# EAGLE design SeCloud (EAGLE 7.2.0)
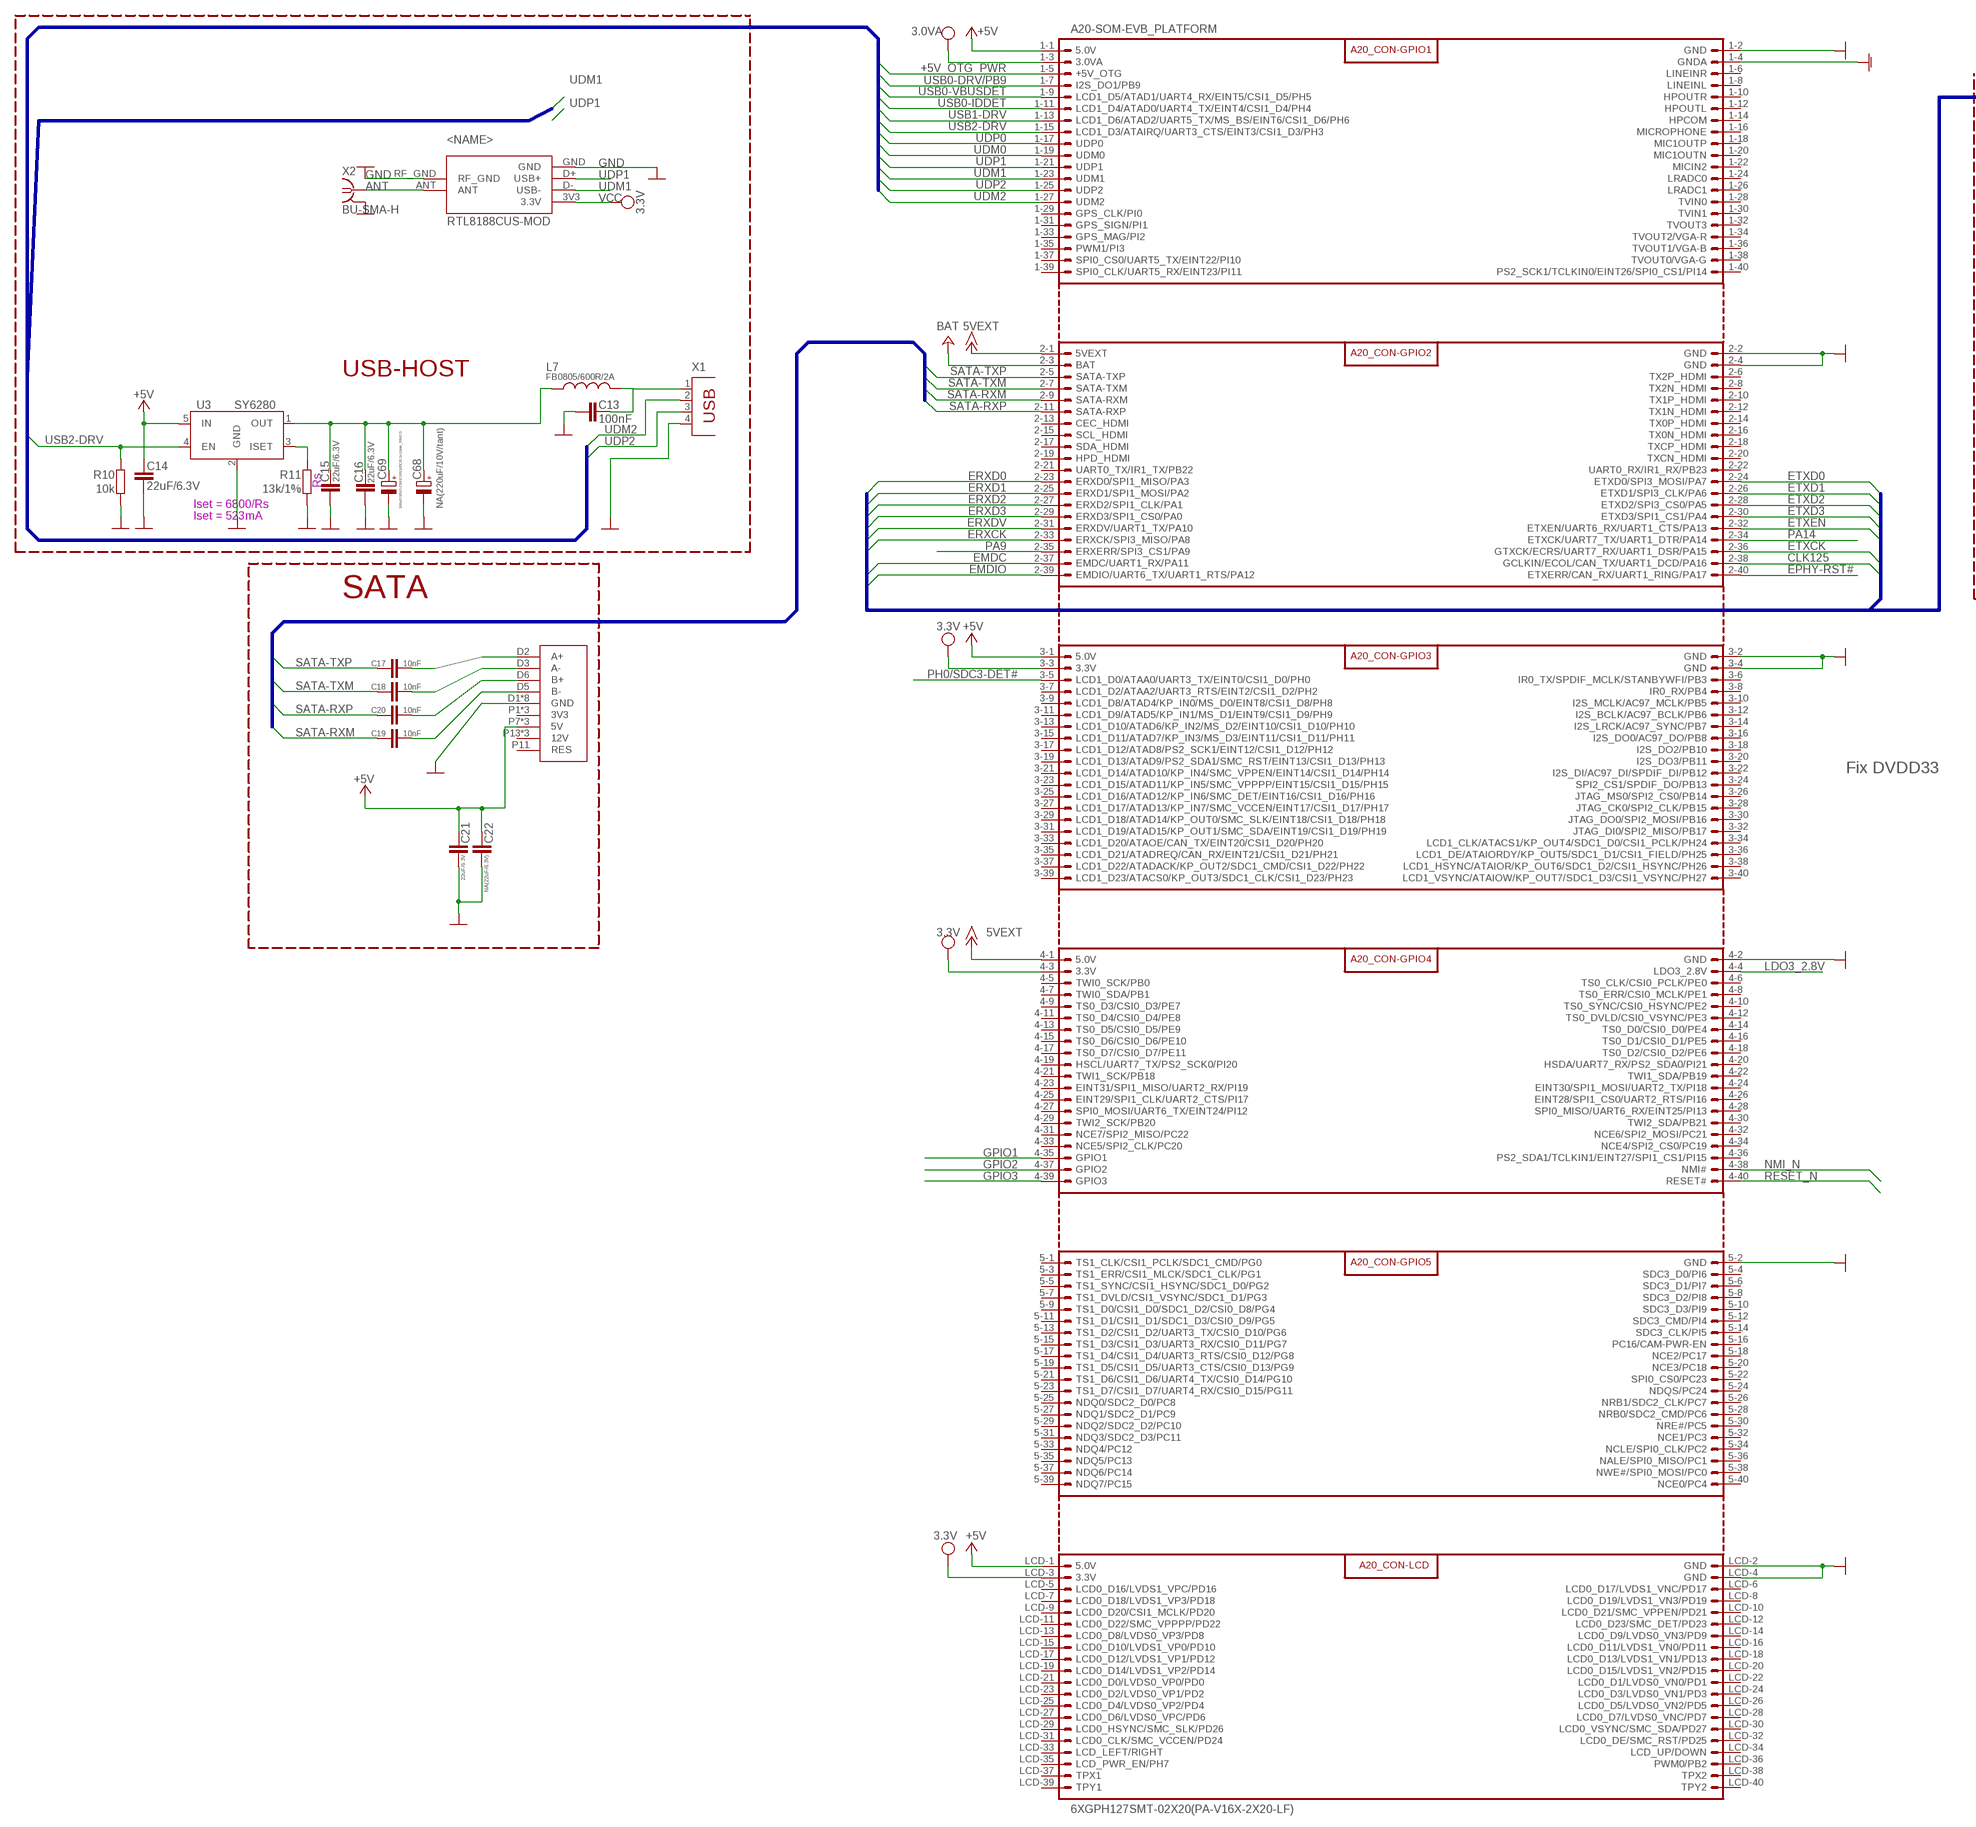
[diagram p0: schematic, sheet 1, part 1 of 2]
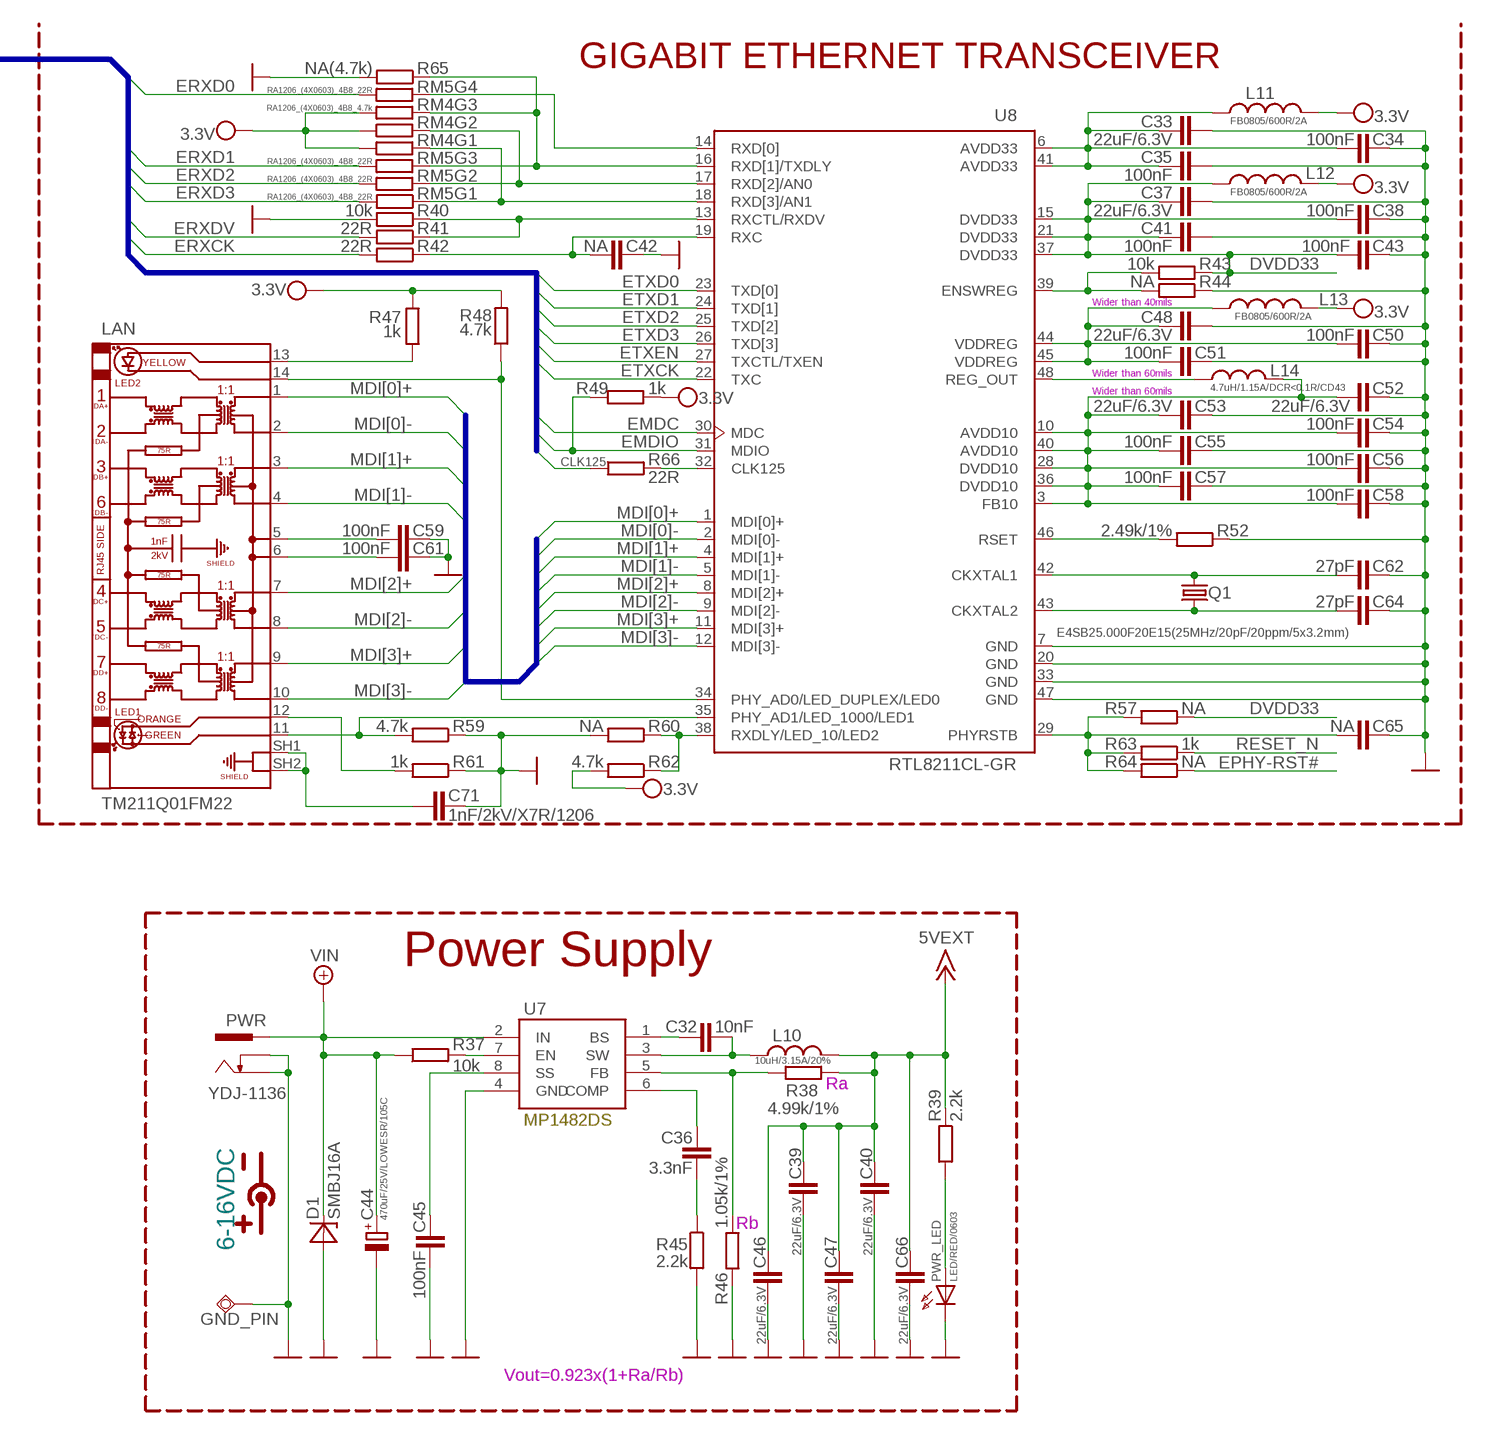
[diagram p1: schematic, sheet 1, part 2 of 2]

## Parts
A20-SOM-EVB_PLATFORM  6XGPH127SMT-02X20(PA-V16X-2X20-LF)  A20-SOM-EVB---6XGPH127SMT-02X20(PA-V16X-2X20-LF)  [A20-SOM-EVB]
C13  100nF  C-EUC0603_DWS  [C0603_DWS]
C14  22uF/6.3V  C-EUC0603_DWS  [C0603_DWS]
C15  22uF/6.3V  C-EUC0603_DWS  [C0603_DWS]
C16  22uF/6.3V  C-EUC0603_DWS  [C0603_DWS]
C17  10nF  C-EUC0603_DWS  [C0603_DWS]
C18  10nF  C-EUC0603_DWS  [C0603_DWS]
C19  10nF  C-EUC0603_DWS  [C0603_DWS]
C20  10nF  C-EUC0603_DWS  [C0603_DWS]
C21  22uF/6.3V  C-EUC0603_DWS  [C0603_DWS]
C22  NA(22uF/6.3V)  C-EUC0603_DWS  [C0603_DWS]
C32  10nF  C-EUC0603_DWS  [C0603_DWS]
C33  22uF/6.3V  C-EUC0603_DWS  [C0603_DWS]
C34  100nF  C-EUC0603_DWS  [C0603_DWS]
C35  100nF  C-EUC0603_DWS  [C0603_DWS]
C36  3.3nF  C-EUC0603_DWS  [C0603_DWS]
C37  22uF/6.3V  C-EUC0603_DWS  [C0603_DWS]
C38  100nF  C-EUC0603_DWS  [C0603_DWS]
C39  22uF/6.3V  C-EUC0603_DWS  [C0603_DWS]
C40  22uF/6.3V  C-EUC0603_DWS  [C0603_DWS]
C41  100nF  C-EUC0603_DWS  [C0603_DWS]
C42  NA  C-EUC0603_DWS  [C0603_DWS]
C43  100nF  C-EUC0603_DWS  [C0603_DWS]
C44  470uF/25V/LOWESR/105C  CPOL-EUE3.5-8  [E3,5-8]
C45  100nF  C-EUC0603_DWS  [C0603_DWS]
C46  22uF/6.3V  C-EUC0603_DWS  [C0603_DWS]
C47  22uF/6.3V  C-EUC0603_DWS  [C0603_DWS]
C48  22uF/6.3V  C-EUC0603_DWS  [C0603_DWS]
C50  100nF  C-EUC0603_DWS  [C0603_DWS]
C51  100nF  C-EUC0603_DWS  [C0603_DWS]
C52  22uF/6.3V  C-EUC0603_DWS  [C0603_DWS]
C53  22uF/6.3V  C-EUC0603_DWS  [C0603_DWS]
C54  100nF  C-EUC0603_DWS  [C0603_DWS]
C55  100nF  C-EUC0603_DWS  [C0603_DWS]
C56  100nF  C-EUC0603_DWS  [C0603_DWS]
C57  100nF  C-EUC0603_DWS  [C0603_DWS]
C58  100nF  C-EUC0603_DWS  [C0603_DWS]
C59  100nF  C-EUC0603_DWS  [C0603_DWS]
C61  100nF  C-EUC0603_DWS  [C0603_DWS]
C62  27pF  C-EUC0603_DWS  [C0603_DWS]
C64  27pF  C-EUC0603_DWS  [C0603_DWS]
C65  NA  C-EUC0603_DWS  [C0603_DWS]
C66  22uF/6.3V  C-EUC0603_DWS  [C0603_DWS]
C68  NA(220uF/10V/tant)  CPOL-EUCT7343  [CT7343]
C69  100uF/16V/LOWESR/105C/6.3x11mm_RM2.5  CPOL-EUE2.5-6.3  [E2,5-6,3]
C71  1nF/2kV/X7R/1206  C-EUC1206_5MILS_WS_ISO  [C1206_5MILS_WS_ISO]
D1  SMBJ16A  [DO214AA]
GND_PIN  TESTPAD3  [TEST_PAD40/70/SQUARE]
L7  FB0805/600R/2A  L-USL0805_5MIL_DWS  [L0805_5MIL_DWS]
L10  10uH/3.15A/20%  LL  [8X7MM_3131]
L11  FB0805/600R/2A  L-USL0805_5MIL_DWS  [L0805_5MIL_DWS]
L12  FB0805/600R/2A  L-USL0805_5MIL_DWS  [L0805_5MIL_DWS]
L13  FB0805/600R/2A  L-USL0805_5MIL_DWS  [L0805_5MIL_DWS]
L14  4.7uH/1.15A/DCR<0.1R/CD43  L-CD42(43)  [CD42(43)]
LAN  TM211Q01FM22  TM211Q01FM22_SH  [TM211Q01FM22_SH]
PWR  YDJ-1136  PWR-JAKPWR_JACK_UNI_MILLING  [PWR_JACK_UNI_MILLING]
PWR_LED  LED/RED/0603  LED0603DWS  [LED-0603]
Q1  E4SB25.000F20E15(25MHz/20pF/20ppm/5x3.2mm)  HC49/S_E4SB25.000F20E15  [HCX-4S]
R10  10k  R-EU_R0603_5MIL_DWS  [R0603_5MIL_DWS]
R11  13k/1%  R-EU_R0603_5MIL_DWS  [R0603_5MIL_DWS]
R37  10k  R-EU_R0603_5MIL_DWS  [R0603_5MIL_DWS]
R38  4.99k/1%  R-EU_R0603_5MIL_DWS  [R0603_5MIL_DWS]
R39  2.2k  R-EU_R0603_5MIL_DWS  [R0603_5MIL_DWS]
R40  10k  R-EU_R0603_5MIL_DWS  [R0603_5MIL_DWS]
R41  22R  R-EU_R0603_5MIL_DWS  [R0603_5MIL_DWS]
R42  22R  R-EU_R0603_5MIL_DWS  [R0603_5MIL_DWS]
R43  10k  R-EU_R0603_5MIL_DWS  [R0603_5MIL_DWS]
R44  NA  R-EU_R0603_5MIL_DWS  [R0603_5MIL_DWS]
R45  2.2k  R-EU_R0603_5MIL_DWS  [R0603_5MIL_DWS]
R46  1.05k/1%  R-EU_R0603_5MIL_DWS  [R0603_5MIL_DWS]
R47  1k  R-EU_R0603_5MIL_DWS  [R0603_5MIL_DWS]
R48  4.7k  R-EU_R0603_5MIL_DWS  [R0603_5MIL_DWS]
R49  1k  R-EU_R0603_5MIL_DWS  [R0603_5MIL_DWS]
R52  2.49k/1%  R-EU_R0603_5MIL_DWS  [R0603_5MIL_DWS]
R57  NA  R-EU_R0603_5MIL_DWS  [R0603_5MIL_DWS]
R59  4.7k  R-EU_R0603_5MIL_DWS  [R0603_5MIL_DWS]
R60  NA  R-EU_R0603_5MIL_DWS  [R0603_5MIL_DWS]
R61  1k  R-EU_R0603_5MIL_DWS  [R0603_5MIL_DWS]
R62  4.7k  R-EU_R0603_5MIL_DWS  [R0603_5MIL_DWS]
R63  1k  R-EU_R0603_5MIL_DWS  [R0603_5MIL_DWS]
R64  NA  R-EU_R0603_5MIL_DWS  [R0603_5MIL_DWS]
R65  NA(4.7k)  R-EU_R0603_5MIL_DWS  [R0603_5MIL_DWS]
R66  22R  R-EU_R0603_5MIL_DWS  [R0603_5MIL_DWS]
RM4  RA1206_(4X0603)_4B8_4.7k  R_MATRIX_4E  [R_MATRIX_4]
RM5  RA1206_(4X0603)_4B8_22R  R_MATRIX_4E  [R_MATRIX_4]
U3  SY6280  [SOT23-5]
U7  MP1482DS  MP1482  [SOIC8]
U8  RTL8211CL-GR  [LQFP48]
U$1  RTL8188CUS-MOD  [RTL8188CUS-MOD]
U$2  SATA-CON  [SATA-CON]
X1  PN87520  [PN87520]
X2  BU-SMA-H  [BU-SMA-H]

## Nets
+5V: A20-SOM-EVB_PLATFORM.1-1(5.0V) A20-SOM-EVB_PLATFORM.3-1(5.0V) A20-SOM-EVB_PLATFORM.LCD-1(5.0V) C14.1 C21.2 C22.2 U3.5(IN) U$2.P7(5V) U$2.P8(5V) U$2.P9(5V)
+5V_OTG_PWR: A20-SOM-EVB_PLATFORM.1-5(+5V_OTG)
+12V: C44.+ D1.C PWR.+ R37.1 U7.2(IN) ; supply symbol labelled VIN
+15V: A20-SOM-EVB_PLATFORM.2-1(5VEXT) A20-SOM-EVB_PLATFORM.4-1(5.0V) C39.1 C40.1 C46.1 C47.1 C66.1 L10.2 R38.2 R39.1 ; supply symbol labelled 5VEXT
+24V: A20-SOM-EVB_PLATFORM.2-3(BAT) ; supply symbol labelled BAT
ANT: U$1.ANT X2.1
AVDD33: C33.2 C34.2 C35.2 L11.2 U8.6(AVDD33) U8.41(AVDD33)
AVDD/DVDD(1.05V): C52.2 C53.2 C54.2 C55.2 C56.2 C57.2 C58.2 L14.2 U8.3(FB10) U8.10(AVDD10) U8.28(DVDD10) U8.36(DVDD10) U8.40(AVDD10)
CLK125: A20-SOM-EVB_PLATFORM.2-38(GCLKIN/ECOL/CAN_TX/UART1_DCD/PA16) R66.1
DVDD33: C37.2 C38.2 C41.2 C43.2 L12.2 R43.1 R57.1 U8.15(DVDD33) U8.21(DVDD33) U8.37(DVDD33)
EMDC: A20-SOM-EVB_PLATFORM.2-37(EMDC/UART1_RX/PA11) U8.30(MDC)
EMDIO: A20-SOM-EVB_PLATFORM.2-39(EMDIO/UART6_TX/UART1_RTS/PA12) R49.1 U8.31(MDIO)
EPHY-RST#: A20-SOM-EVB_PLATFORM.2-40(ETXERR/CAN_RX/UART1_RING/PA17) R64.1
ERXCK: A20-SOM-EVB_PLATFORM.2-33(ERXCK/SPI3_MISO/PA8) R42.2
ERXD0: A20-SOM-EVB_PLATFORM.2-23(ERXD0/SPI1_MISO/PA3) RM5.4.2
ERXD1: A20-SOM-EVB_PLATFORM.2-25(ERXD1/SPI1_MOSI/PA2) RM5.3.2
ERXD2: A20-SOM-EVB_PLATFORM.2-27(ERXD2/SPI1_CLK/PA1) RM5.2.2
ERXD3: A20-SOM-EVB_PLATFORM.2-29(ERXD3/SPI1_CS0/PA0) RM5.1.2
ERXDV: A20-SOM-EVB_PLATFORM.2-31(ERXDV/UART1_TX/PA10) R41.2
ETXCK: A20-SOM-EVB_PLATFORM.2-36(GTXCK/ECRS/UART7_RX/UART1_DSR/PA15) U8.22(TXC)
ETXD0: A20-SOM-EVB_PLATFORM.2-24(ETXD0/SPI3_MOSI/PA7) U8.23(TXD[0])
ETXD1: A20-SOM-EVB_PLATFORM.2-26(ETXD1/SPI3_CLK/PA6) U8.24(TXD[1])
ETXD2: A20-SOM-EVB_PLATFORM.2-28(ETXD2/SPI3_CS0/PA5) U8.25(TXD[2])
ETXD3: A20-SOM-EVB_PLATFORM.2-30(ETXD3/SPI1_CS1/PA4) U8.26(TXD[3])
ETXEN: A20-SOM-EVB_PLATFORM.2-32(ETXEN/UART6_RX/UART1_CTS/PA13) U8.27(TXCTL/TXEN)
GND [pwr]: A20-SOM-EVB_PLATFORM.1-2(GND) A20-SOM-EVB_PLATFORM.2-2(GND) A20-SOM-EVB_PLATFORM.2-4(GND) A20-SOM-EVB_PLATFORM.3-2(GND) A20-SOM-EVB_PLATFORM.3-4(GND) A20-SOM-EVB_PLATFORM.4-2(GND) A20-SOM-EVB_PLATFORM.5-2(GND) A20-SOM-EVB_PLATFORM.LCD-2(GND) A20-SOM-EVB_PLATFORM.LCD-4(GND) C13.2 C14.2 C15.2 C16.2 C21.1 C22.1 C33.1 C34.1 C35.1 C37.1 C38.1 C39.2 C40.2 C41.1 C42.2 C43.1 C44.- C45.2 C46.2 C47.2 C48.1 C50.1 C51.1 C52.1 C53.1 C54.1 C55.1 C56.1 C57.1 C58.1 C59.1 C61.1 C62.1 C64.1 C65.1 C66.2 C68.- C69.- C71.1 D1.A GND_PIN.P$1(PP) PWR.- PWR.-- PWR_LED.C R10.1 R11.1 R40.2 R44.1 R45.2 R46.2 R52.1 R59.1 R60.2 R61.1 R65.2 U3.2(GND) U7.4(GND) U8.7(GND) U8.20(GND) U8.33(GND) U8.47(GND) U$1.GND U$1.RF_GND U$2.D1(GND) U$2.D4(GND) U$2.D7(GND) U$2.P4(GND) U$2.P5(GND) U$2.P6(GND) U$2.P10(GND) U$2.P12(GND) X1.4 X2.2 X2.3 X2.4 X2.5
GNDA: A20-SOM-EVB_PLATFORM.1-4(GNDA)
GPIO1: A20-SOM-EVB_PLATFORM.4-35(GPIO1)
GPIO2: A20-SOM-EVB_PLATFORM.4-37(GPIO2)
GPIO3: A20-SOM-EVB_PLATFORM.4-39(GPIO3)
LDO3_2.8V [pwr]: A20-SOM-EVB_PLATFORM.4-4(LDO3_2.8V)
MDI[0]+: LAN.1 U8.1(MDI[0]+)
MDI[0]-: LAN.2 U8.2(MDI[0]-)
MDI[1]+: LAN.3 U8.4(MDI[1]+)
MDI[1]-: LAN.4 U8.5(MDI[1]-)
MDI[2]+: LAN.7 U8.8(MDI[2]+)
MDI[2]-: LAN.8 U8.9(MDI[2]-)
MDI[3]+: LAN.9 U8.11(MDI[3]+)
MDI[3]-: LAN.10 U8.12(MDI[3]-)
N$6: C45.1 U7.8(SS)
N$7: R37.2 U7.7(EN)
N$8: C32.1 U7.1(BS)
N$9: C32.2 L10.1 U7.3(SW)
N$10: C36.1 U7.6(COMP)
N$11: C36.2 R45.1
N$12: C71.2 LAN.SH1 LAN.SH2
N$13: R52.2 U8.46(RSET)
N$15: C62.2 Q1.2 U8.42(CKXTAL1)
N$16: C64.2 Q1.1 U8.43(CKXTAL2)
N$17: L14.1 U8.48(REG_OUT)
N$18: C59.2 LAN.5
N$19: C65.2 R57.2 R63.2 R64.2 U8.29(PHYRSTB)
N$20: C61.2 LAN.6
N$21: R60.1 R62.1 U8.38(RXDLY/LED_10/LED2)
N$22: LAN.12 R61.2
N$23: LAN.11 R59.2 U8.35(PHY_AD1/LED_1000/LED1)
N$24: R43.2 R44.2 U8.39(ENSWREG)
N$25: LAN.13 R47.2
N$26: C42.1 R42.1 U8.19(RXC)
N$27: R66.2 U8.32(CLK125)
N$28: R40.1 R41.1 U8.13(RXCTL/RXDV)
N$29: RM5.4.1 U8.14(RXD[0])
N$30: R65.1 RM4.3.1 RM5.3.1 U8.16(RXD[1]/TXDLY)
N$31: RM4.2.1 RM5.2.1 U8.17(RXD[2]/AN0)
N$32: RM4.1.1 RM5.1.1 U8.18(RXD[3]/AN1)
N$46: LAN.14 R48.1 U8.34(PHY_AD0/LED_DUPLEX/LED0)
N$62: R38.1 R46.1 U7.5(FB)
N$106: C17.2 U$2.D2(A+)
N$112: C18.2 U$2.D3(A-)
N$113: C19.2 U$2.D5(B-)
N$114: C20.2 U$2.D6(B+)
N$129: PWR_LED.A R39.2
N$137: R11.2 U3.3(ISET)
N$194: C13.1 L7.2 X1.1
N$195: C15.1 C16.1 C68.+ C69.+ L7.1 U3.1(OUT)
NMI_N: A20-SOM-EVB_PLATFORM.4-38(NMI#)
PA9: A20-SOM-EVB_PLATFORM.2-35(ERXERR/SPI3_CS1/PA9)
PA14: A20-SOM-EVB_PLATFORM.2-34(ETXCK/UART7_TX/UART1_DTR/PA14)
PH0/SDC3-DET#: A20-SOM-EVB_PLATFORM.3-5(LCD1_D0/ATAA0/UART3_TX/EINT0/CSI1_D0/PH0)
RESET_N: A20-SOM-EVB_PLATFORM.4-40(RESET#) R63.1
SATA-RXM: A20-SOM-EVB_PLATFORM.2-9(SATA-RXM) C19.1
SATA-RXP: A20-SOM-EVB_PLATFORM.2-11(SATA-RXP) C20.1
SATA-TXM: A20-SOM-EVB_PLATFORM.2-7(SATA-TXM) C18.1
SATA-TXP: A20-SOM-EVB_PLATFORM.2-5(SATA-TXP) C17.1
UDM0: A20-SOM-EVB_PLATFORM.1-19(UDM0)
UDM1: A20-SOM-EVB_PLATFORM.1-23(UDM1) U$1.D-(USB-)
UDM2: A20-SOM-EVB_PLATFORM.1-27(UDM2) X1.2
UDP0: A20-SOM-EVB_PLATFORM.1-17(UDP0)
UDP1: A20-SOM-EVB_PLATFORM.1-21(UDP1) U$1.D+(USB+)
UDP2: A20-SOM-EVB_PLATFORM.1-25(UDP2) X1.3
USB0-DRV/PB9: A20-SOM-EVB_PLATFORM.1-7(I2S_DO1/PB9)
USB0-IDDET: A20-SOM-EVB_PLATFORM.1-11(LCD1_D4/ATAD0/UART4_TX/EINT4/CSI1_D4/PH4)
USB0-VBUSDET: A20-SOM-EVB_PLATFORM.1-9(LCD1_D5/ATAD1/UART4_RX/EINT5/CSI1_D5/PH5)
USB1-DRV [pwr]: A20-SOM-EVB_PLATFORM.1-13(LCD1_D6/ATAD2/UART5_TX/MS_BS/EINT6/CSI1_D6/PH6)
USB2-DRV [pwr]: A20-SOM-EVB_PLATFORM.1-15(LCD1_D3/ATAIRQ/UART3_CTS/EINT3/CSI1_D3/PH3) R10.2 U3.4(EN)
VCC [pwr]: A20-SOM-EVB_PLATFORM.3-3(3.3V) A20-SOM-EVB_PLATFORM.4-3(3.3V) A20-SOM-EVB_PLATFORM.LCD-3(3.3V) L11.1 L12.1 L13.1 R47.1 R48.2 R49.2 R62.2 RM4.1.2 RM4.2.2 RM4.3.2 U$1.3V3(3.3V) ; supply symbol labelled 3.3V
VDDREG: C48.2 C50.2 C51.2 L13.2 U8.44(VDDREG) U8.45(VDDREG)
VPP [pwr]: A20-SOM-EVB_PLATFORM.1-3(3.0VA) ; supply symbol labelled 3.0VA
Unconnected: A20-SOM-EVB_PLATFORM.1-6(LINEINR) A20-SOM-EVB_PLATFORM.1-8(LINEINL) A20-SOM-EVB_PLATFORM.1-10(HPOUTR) A20-SOM-EVB_PLATFORM.1-12(HPOUTL) A20-SOM-EVB_PLATFORM.1-14(HPCOM) A20-SOM-EVB_PLATFORM.1-16(MICROPHONE) A20-SOM-EVB_PLATFORM.1-18(MIC1OUTP) A20-SOM-EVB_PLATFORM.1-20(MIC1OUTN) A20-SOM-EVB_PLATFORM.1-22(MICIN2) A20-SOM-EVB_PLATFORM.1-24(LRADC0) A20-SOM-EVB_PLATFORM.1-26(LRADC1) A20-SOM-EVB_PLATFORM.1-28(TVIN0) A20-SOM-EVB_PLATFORM.1-29(GPS_CLK/PI0) A20-SOM-EVB_PLATFORM.1-30(TVIN1) A20-SOM-EVB_PLATFORM.1-31(GPS_SIGN/PI1) A20-SOM-EVB_PLATFORM.1-32(TVOUT3) A20-SOM-EVB_PLATFORM.1-33(GPS_MAG/PI2) A20-SOM-EVB_PLATFORM.1-34(TVOUT2/VGA-R) A20-SOM-EVB_PLATFORM.1-35(PWM1/PI3) A20-SOM-EVB_PLATFORM.1-36(TVOUT1/VGA-B) A20-SOM-EVB_PLATFORM.1-37(SPI0_CS0/UART5_TX/EINT22/PI10) A20-SOM-EVB_PLATFORM.1-38(TVOUT0/VGA-G) A20-SOM-EVB_PLATFORM.1-39(SPI0_CLK/UART5_RX/EINT23/PI11) A20-SOM-EVB_PLATFORM.1-40(PS2_SCK1/TCLKIN0/EINT26/SPI0_CS1/PI14) A20-SOM-EVB_PLATFORM.2-6(TX2P_HDMI) A20-SOM-EVB_PLATFORM.2-8(TX2N_HDMI) A20-SOM-EVB_PLATFORM.2-10(TX1P_HDMI) A20-SOM-EVB_PLATFORM.2-12(TX1N_HDMI) A20-SOM-EVB_PLATFORM.2-13(CEC_HDMI) A20-SOM-EVB_PLATFORM.2-14(TX0P_HDMI) A20-SOM-EVB_PLATFORM.2-15(SCL_HDMI) A20-SOM-EVB_PLATFORM.2-16(TX0N_HDMI) A20-SOM-EVB_PLATFORM.2-17(SDA_HDMI) A20-SOM-EVB_PLATFORM.2-18(TXCP_HDMI) A20-SOM-EVB_PLATFORM.2-19(HPD_HDMI) A20-SOM-EVB_PLATFORM.2-20(TXCN_HDMI) A20-SOM-EVB_PLATFORM.2-21(UART0_TX/IR1_TX/PB22) A20-SOM-EVB_PLATFORM.2-22(UART0_RX/IR1_RX/PB23) A20-SOM-EVB_PLATFORM.3-6(IR0_TX/SPDIF_MCLK/STANBYWFI/PB3) A20-SOM-EVB_PLATFORM.3-7(LCD1_D2/ATAA2/UART3_RTS/EINT2/CSI1_D2/PH2) A20-SOM-EVB_PLATFORM.3-8(IR0_RX/PB4) A20-SOM-EVB_PLATFORM.3-9(LCD1_D8/ATAD4/KP_IN0/MS_D0/EINT8/CSI1_D8/PH8) A20-SOM-EVB_PLATFORM.3-10(I2S_MCLK/AC97_MCLK/PB5) A20-SOM-EVB_PLATFORM.3-11(LCD1_D9/ATAD5/KP_IN1/MS_D1/EINT9/CSI1_D9/PH9) A20-SOM-EVB_PLATFORM.3-12(I2S_BCLK/AC97_BCLK/PB6) A20-SOM-EVB_PLATFORM.3-13(LCD1_D10/ATAD6/KP_IN2/MS_D2/EINT10/CSI1_D10/PH10) A20-SOM-EVB_PLATFORM.3-14(I2S_LRCK/AC97_SYNC/PB7) A20-SOM-EVB_PLATFORM.3-15(LCD1_D11/ATAD7/KP_IN3/MS_D3/EINT11/CSI1_D11/PH11) A20-SOM-EVB_PLATFORM.3-16(I2S_DO0/AC97_DO/PB8) A20-SOM-EVB_PLATFORM.3-17(LCD1_D12/ATAD8/PS2_SCK1/EINT12/CSI1_D12/PH12) A20-SOM-EVB_PLATFORM.3-18(I2S_DO2/PB10) A20-SOM-EVB_PLATFORM.3-19(LCD1_D13/ATAD9/PS2_SDA1/SMC_RST/EINT13/CSI1_D13/PH13) A20-SOM-EVB_PLATFORM.3-20(I2S_DO3/PB11) A20-SOM-EVB_PLATFORM.3-21(LCD1_D14/ATAD10/KP_IN4/SMC_VPPEN/EINT14/CSI1_D14/PH14) A20-SOM-EVB_PLATFORM.3-22(I2S_DI/AC97_DI/SPDIF_DI/PB12) A20-SOM-EVB_PLATFORM.3-23(LCD1_D15/ATAD11/KP_IN5/SMC_VPPPP/EINT15/CSI1_D15/PH15) A20-SOM-EVB_PLATFORM.3-24(SPI2_CS1/SPDIF_DO/PB13) A20-SOM-EVB_PLATFORM.3-25(LCD1_D16/ATAD12/KP_IN6/SMC_DET/EINT16/CSI1_D16/PH16) A20-SOM-EVB_PLATFORM.3-26(JTAG_MS0/SPI2_CS0/PB14) A20-SOM-EVB_PLATFORM.3-27(LCD1_D17/ATAD13/KP_IN7/SMC_VCCEN/EINT17/CSI1_D17/PH17) A20-SOM-EVB_PLATFORM.3-28(JTAG_CK0/SPI2_CLK/PB15) A20-SOM-EVB_PLATFORM.3-29(LCD1_D18/ATAD14/KP_OUT0/SMC_SLK/EINT18/CSI1_D18/PH18) A20-SOM-EVB_PLATFORM.3-30(JTAG_DO0/SPI2_MOSI/PB16) A20-SOM-EVB_PLATFORM.3-31(LCD1_D19/ATAD15/KP_OUT1/SMC_SDA/EINT19/CSI1_D19/PH19) A20-SOM-EVB_PLATFORM.3-32(JTAG_DI0/SPI2_MISO/PB17) A20-SOM-EVB_PLATFORM.3-33(LCD1_D20/ATAOE/CAN_TX/EINT20/CSI1_D20/PH20) A20-SOM-EVB_PLATFORM.3-34(LCD1_CLK/ATACS1/KP_OUT4/SDC1_D0/CSI1_PCLK/PH24) A20-SOM-EVB_PLATFORM.3-35(LCD1_D21/ATADREQ/CAN_RX/EINT21/CSI1_D21/PH21) A20-SOM-EVB_PLATFORM.3-36(LCD1_DE/ATAIORDY/KP_OUT5/SDC1_D1/CSI1_FIELD/PH25) A20-SOM-EVB_PLATFORM.3-37(LCD1_D22/ATADACK/KP_OUT2/SDC1_CMD/CSI1_D22/PH22) A20-SOM-EVB_PLATFORM.3-38(LCD1_HSYNC/ATAIOR/KP_OUT6/SDC1_D2/CSI1_HSYNC/PH26) A20-SOM-EVB_PLATFORM.3-39(LCD1_D23/ATACS0/KP_OUT3/SDC1_CLK/CSI1_D23/PH23) A20-SOM-EVB_PLATFORM.3-40(LCD1_VSYNC/ATAIOW/KP_OUT7/SDC1_D3/CSI1_VSYNC/PH27) A20-SOM-EVB_PLATFORM.4-5(TWI0_SCK/PB0) A20-SOM-EVB_PLATFORM.4-6(TS0_CLK/CSI0_PCLK/PE0) A20-SOM-EVB_PLATFORM.4-7(TWI0_SDA/PB1) A20-SOM-EVB_PLATFORM.4-8(TS0_ERR/CSI0_MCLK/PE1) A20-SOM-EVB_PLATFORM.4-9(TS0_D3/CSI0_D3/PE7) A20-SOM-EVB_PLATFORM.4-10(TS0_SYNC/CSI0_HSYNC/PE2) A20-SOM-EVB_PLATFORM.4-11(TS0_D4/CSI0_D4/PE8) A20-SOM-EVB_PLATFORM.4-12(TS0_DVLD/CSI0_VSYNC/PE3) A20-SOM-EVB_PLATFORM.4-13(TS0_D5/CSI0_D5/PE9) A20-SOM-EVB_PLATFORM.4-14(TS0_D0/CSI0_D0/PE4) A20-SOM-EVB_PLATFORM.4-15(TS0_D6/CSI0_D6/PE10) A20-SOM-EVB_PLATFORM.4-16(TS0_D1/CSI0_D1/PE5) A20-SOM-EVB_PLATFORM.4-17(TS0_D7/CSI0_D7/PE11) A20-SOM-EVB_PLATFORM.4-18(TS0_D2/CSI0_D2/PE6) A20-SOM-EVB_PLATFORM.4-19(HSCL/UART7_TX/PS2_SCK0/PI20) A20-SOM-EVB_PLATFORM.4-20(HSDA/UART7_RX/PS2_SDA0/PI21) A20-SOM-EVB_PLATFORM.4-21(TWI1_SCK/PB18) A20-SOM-EVB_PLATFORM.4-22(TWI1_SDA/PB19) A20-SOM-EVB_PLATFORM.4-23(EINT31/SPI1_MISO/UART2_RX/PI19) A20-SOM-EVB_PLATFORM.4-24(EINT30/SPI1_MOSI/UART2_TX/PI18) A20-SOM-EVB_PLATFORM.4-25(EINT29/SPI1_CLK/UART2_CTS/PI17) A20-SOM-EVB_PLATFORM.4-26(EINT28/SPI1_CS0/UART2_RTS/PI16) A20-SOM-EVB_PLATFORM.4-27(SPI0_MOSI/UART6_TX/EINT24/PI12) A20-SOM-EVB_PLATFORM.4-28(SPI0_MISO/UART6_RX/EINT25/PI13) A20-SOM-EVB_PLATFORM.4-29(TWI2_SCK/PB20) A20-SOM-EVB_PLATFORM.4-30(TWI2_SDA/PB21) A20-SOM-EVB_PLATFORM.4-31(NCE7/SPI2_MISO/PC22) A20-SOM-EVB_PLATFORM.4-32(NCE6/SPI2_MOSI/PC21) A20-SOM-EVB_PLATFORM.4-33(NCE5/SPI2_CLK/PC20) A20-SOM-EVB_PLATFORM.4-34(NCE4/SPI2_CS0/PC19) A20-SOM-EVB_PLATFORM.4-36(PS2_SDA1/TCLKIN1/EINT27/SPI1_CS1/PI15) A20-SOM-EVB_PLATFORM.5-1(TS1_CLK/CSI1_PCLK/SDC1_CMD/PG0) A20-SOM-EVB_PLATFORM.5-3(TS1_ERR/CSI1_MLCK/SDC1_CLK/PG1) A20-SOM-EVB_PLATFORM.5-4(SDC3_D0/PI6) A20-SOM-EVB_PLATFORM.5-5(TS1_SYNC/CSI1_HSYNC/SDC1_D0/PG2) A20-SOM-EVB_PLATFORM.5-6(SDC3_D1/PI7) A20-SOM-EVB_PLATFORM.5-7(TS1_DVLD/CSI1_VSYNC/SDC1_D1/PG3) A20-SOM-EVB_PLATFORM.5-8(SDC3_D2/PI8) A20-SOM-EVB_PLATFORM.5-9(TS1_D0/CSI1_D0/SDC1_D2/CSI0_D8/PG4) A20-SOM-EVB_PLATFORM.5-10(SDC3_D3/PI9) A20-SOM-EVB_PLATFORM.5-11(TS1_D1/CSI1_D1/SDC1_D3/CSI0_D9/PG5) A20-SOM-EVB_PLATFORM.5-12(SDC3_CMD/PI4) A20-SOM-EVB_PLATFORM.5-13(TS1_D2/CSI1_D2/UART3_TX/CSI0_D10/PG6) A20-SOM-EVB_PLATFORM.5-14(SDC3_CLK/PI5) A20-SOM-EVB_PLATFORM.5-15(TS1_D3/CSI1_D3/UART3_RX/CSI0_D11/PG7) A20-SOM-EVB_PLATFORM.5-16(PC16/CAM-PWR-EN) A20-SOM-EVB_PLATFORM.5-17(TS1_D4/CSI1_D4/UART3_RTS/CSI0_D12/PG8) A20-SOM-EVB_PLATFORM.5-18(NCE2/PC17) A20-SOM-EVB_PLATFORM.5-19(TS1_D5/CSI1_D5/UART3_CTS/CSI0_D13/PG9) A20-SOM-EVB_PLATFORM.5-20(NCE3/PC18) A20-SOM-EVB_PLATFORM.5-21(TS1_D6/CSI1_D6/UART4_TX/CSI0_D14/PG10) A20-SOM-EVB_PLATFORM.5-22(SPI0_CS0/PC23) A20-SOM-EVB_PLATFORM.5-23(TS1_D7/CSI1_D7/UART4_RX/CSI0_D15/PG11) A20-SOM-EVB_PLATFORM.5-24(NDQS/PC24) A20-SOM-EVB_PLATFORM.5-25(NDQ0/SDC2_D0/PC8) A20-SOM-EVB_PLATFORM.5-26(NRB1/SDC2_CLK/PC7) A20-SOM-EVB_PLATFORM.5-27(NDQ1/SDC2_D1/PC9) A20-SOM-EVB_PLATFORM.5-28(NRB0/SDC2_CMD/PC6) A20-SOM-EVB_PLATFORM.5-29(NDQ2/SDC2_D2/PC10) A20-SOM-EVB_PLATFORM.5-30(NRE#/PC5) A20-SOM-EVB_PLATFORM.5-31(NDQ3/SDC2_D3/PC11) A20-SOM-EVB_PLATFORM.5-32(NCE1/PC3) A20-SOM-EVB_PLATFORM.5-33(NDQ4/PC12) A20-SOM-EVB_PLATFORM.5-34(NCLE/SPI0_CLK/PC2) A20-SOM-EVB_PLATFORM.5-35(NDQ5/PC13) A20-SOM-EVB_PLATFORM.5-36(NALE/SPI0_MISO/PC1) A20-SOM-EVB_PLATFORM.5-37(NDQ6/PC14) A20-SOM-EVB_PLATFORM.5-38(NWE#/SPI0_MOSI/PC0) A20-SOM-EVB_PLATFORM.5-39(NDQ7/PC15) A20-SOM-EVB_PLATFORM.5-40(NCE0/PC4) A20-SOM-EVB_PLATFORM.LCD-5(LCD0_D16/LVDS1_VPC/PD16) A20-SOM-EVB_PLATFORM.LCD-6(LCD0_D17/LVDS1_VNC/PD17) A20-SOM-EVB_PLATFORM.LCD-7(LCD0_D18/LVDS1_VP3/PD18) A20-SOM-EVB_PLATFORM.LCD-8(LCD0_D19/LVDS1_VN3/PD19) A20-SOM-EVB_PLATFORM.LCD-9(LCD0_D20/CSI1_MCLK/PD20) A20-SOM-EVB_PLATFORM.LCD-10(LCD0_D21/SMC_VPPEN/PD21) A20-SOM-EVB_PLATFORM.LCD-11(LCD0_D22/SMC_VPPPP/PD22) A20-SOM-EVB_PLATFORM.LCD-12(LCD0_D23/SMC_DET/PD23) A20-SOM-EVB_PLATFORM.LCD-13(LCD0_D8/LVDS0_VP3/PD8) A20-SOM-EVB_PLATFORM.LCD-14(LCD0_D9/LVDS0_VN3/PD9) A20-SOM-EVB_PLATFORM.LCD-15(LCD0_D10/LVDS1_VP0/PD10) A20-SOM-EVB_PLATFORM.LCD-16(LCD0_D11/LVDS1_VN0/PD11) A20-SOM-EVB_PLATFORM.LCD-17(LCD0_D12/LVDS1_VP1/PD12) A20-SOM-EVB_PLATFORM.LCD-18(LCD0_D13/LVDS1_VN1/PD13) A20-SOM-EVB_PLATFORM.LCD-19(LCD0_D14/LVDS1_VP2/PD14) A20-SOM-EVB_PLATFORM.LCD-20(LCD0_D15/LVDS1_VN2/PD15) A20-SOM-EVB_PLATFORM.LCD-21(LCD0_D0/LVDS0_VP0/PD0) A20-SOM-EVB_PLATFORM.LCD-22(LCD0_D1/LVDS0_VN0/PD1) A20-SOM-EVB_PLATFORM.LCD-23(LCD0_D2/LVDS0_VP1/PD2) A20-SOM-EVB_PLATFORM.LCD-24(LCD0_D3/LVDS0_VN1/PD3) A20-SOM-EVB_PLATFORM.LCD-25(LCD0_D4/LVDS0_VP2/PD4) A20-SOM-EVB_PLATFORM.LCD-26(LCD0_D5/LVDS0_VN2/PD5) A20-SOM-EVB_PLATFORM.LCD-27(LCD0_D6/LVDS0_VPC/PD6) A20-SOM-EVB_PLATFORM.LCD-28(LCD0_D7/LVDS0_VNC/PD7) A20-SOM-EVB_PLATFORM.LCD-29(LCD0_HSYNC/SMC_SLK/PD26) A20-SOM-EVB_PLATFORM.LCD-30(LCD0_VSYNC/SMC_SDA/PD27) A20-SOM-EVB_PLATFORM.LCD-31(LCD0_CLK/SMC_VCCEN/PD24) A20-SOM-EVB_PLATFORM.LCD-32(LCD0_DE/SMC_RST/PD25) A20-SOM-EVB_PLATFORM.LCD-33(LCD_LEFT/RIGHT) A20-SOM-EVB_PLATFORM.LCD-34(LCD_UP/DOWN) A20-SOM-EVB_PLATFORM.LCD-35(LCD_PWR_EN/PH7) A20-SOM-EVB_PLATFORM.LCD-36(PWM0/PB2) A20-SOM-EVB_PLATFORM.LCD-37(TPX1) A20-SOM-EVB_PLATFORM.LCD-38(TPX2) A20-SOM-EVB_PLATFORM.LCD-39(TPY1) A20-SOM-EVB_PLATFORM.LCD-40(TPY2) RM4.4.1 RM4.4.2 U$2.P1(3V3) U$2.P2(3V3) U$2.P3(3V3) U$2.P11(RES) U$2.P13(12V) U$2.P14(12V) U$2.P15(12V)

## Buses
MDI[0..3]
ETXD[0..3],ETXEN,ETXCK,ERXD[0..3],ERXDV,ERXCK,EMDC,EMDIO,CLK125
UDP[0..2],UDM[0..2],USB0-DRV,USB1-DRV,USB2-DRV,USB0-IDDET,USB0-VBUSDET,+5V_OTG_PWR
SATA-TXP,SATA-TXM,SATA-RXM,SATA-RXP

## Notes on the sheet
- GIGABIT ETHERNET TRANSCEIVER
- Wider than 40mils
- Wider than 60mils
- Wider than 60mils
- USB-HOST
- Rs
- Iset = 6800/Rs
- Iset = 523mA
- SATA
- Power Supply
- Ra
- Fix DVDD33
- Rb
- 6-16VDC
- Vout=0.923x(1+Ra/Rb)

## Library data of the parts
A20-SOM-EVB_PLATFORM = OLIMEX_CASES:A20-SOM-EVB
C13-C22 C32-C43 C45-C48 C50-C59 C61 C62 C64-C66 C71 = rcl:C-EU: CAPACITOR, European symbol
C44 C68 C69 = rcl:CPOL-EU: POLARIZED CAPACITOR, European symbol
D1 = OLIMEX_DISCRET:SMBJ16A
GND_PIN = gogo:TESTPAD: drill 40mils, diameter 70mils
L7 L11-L13 = rcl:L-US: INDUCTOR, American symbol
L10 L14 = OLIMEX_DISCRET:L
LAN = OLIMEX_CONNECTORS:TM211Q01FM22_SH
PWR = gogo:PWR-JAK
PWR_LED = DOUBLE-SIDE:LED
Q1 = crystal:HC49/S: CRYSTAL
R10 R11 R37-R49 R52 R57 R59-R66 = rcl:R-EU_: RESISTOR, European symbol
RM4 RM5 = OLIMEX_DISCRET:R_MATRIX_4E
U3 = OLIMEX_IC:SY6280
U7 = OLIMEX_IC:MP1482
U8 = OLIMEX_IC:RTL8211CL-GR: RTL8211CL-GR INTEGRATED 10/100/1000 GIGABIT ETHERNET TRANSCEIVER This element was created by Penko Bozhkov
U$1 = SeCloud:RTL8188CUS-MOD
U$2 = SeCloud:SATA-CON
X1 = con-berg:PN87520: BERG USB connector; OC_FARNELL: unknown; OC_NEWARK: unknown
X2 = con-coax:BU-SMA-H: FEMALE SMA CONNECTOR Radiall; OC_FARNELL: unknown; OC_NEWARK: unknown

## Board
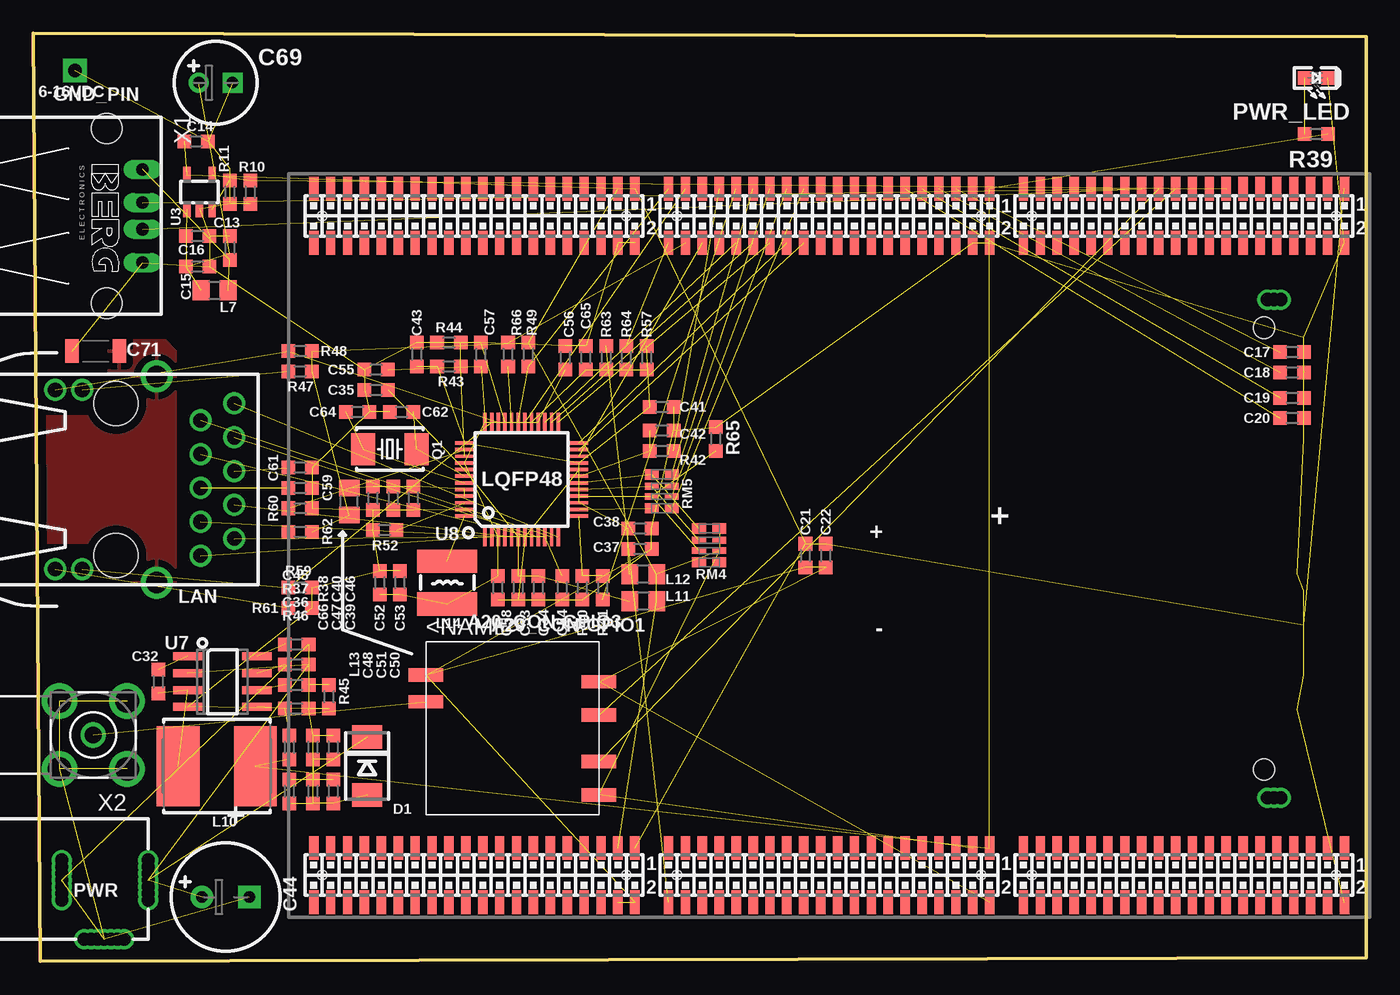
[diagram p2: board, top side]
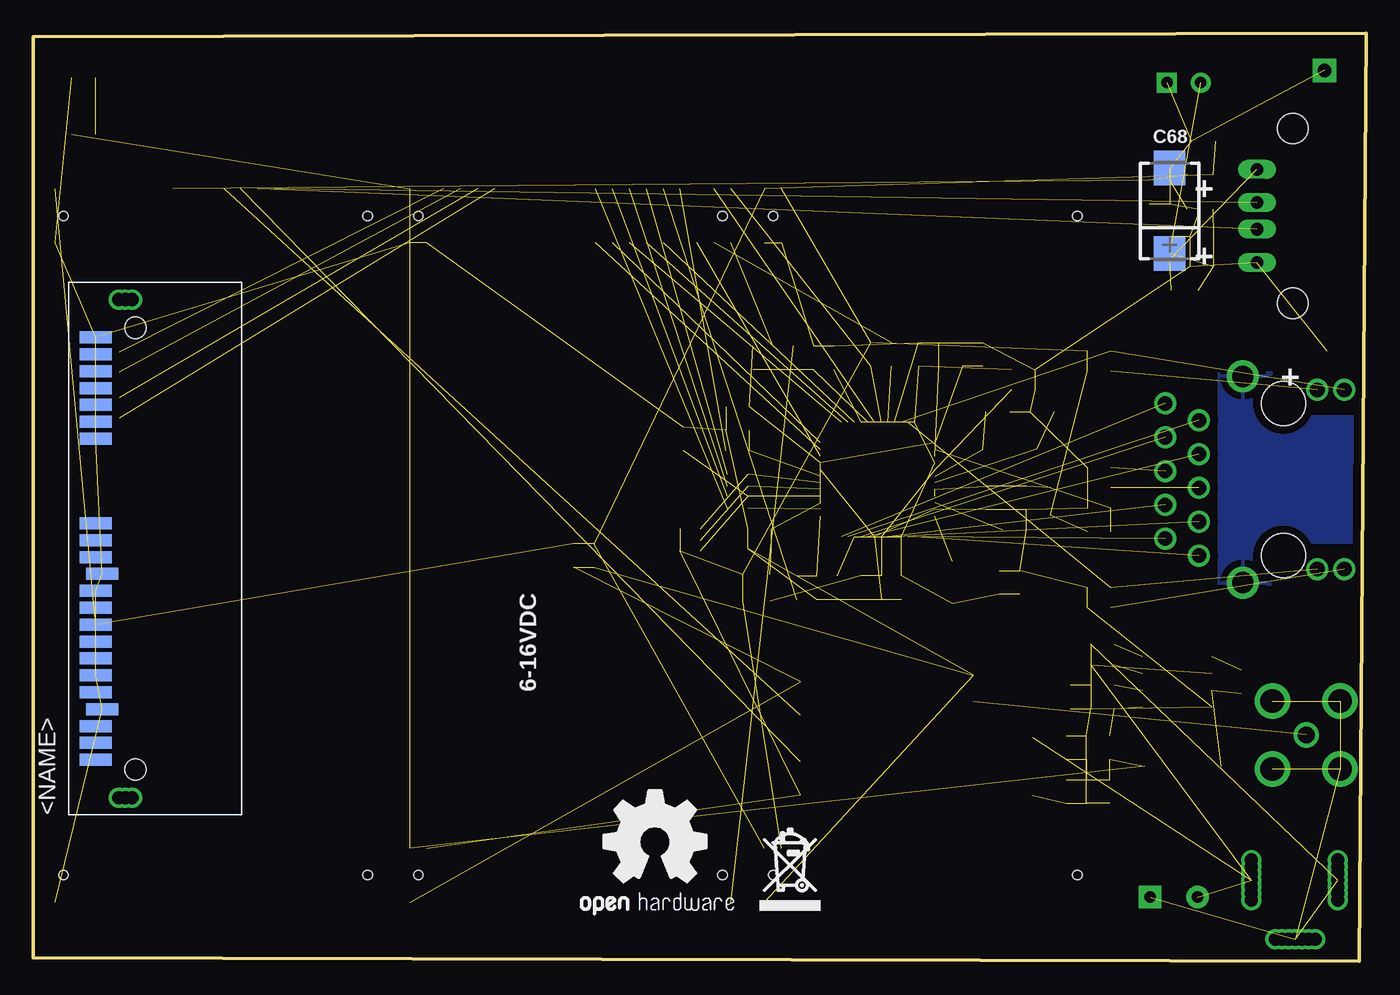
[diagram p3: board, bottom side, seen from below]

Size 100.19 x 69.72 mm. Coordinates in mm from the lower left corner, seen from the top.
Outline: 0,69.72 0.51,0 100.19,0.25 100.19,69.47 0,69.72
Copper layers (1+16): Top 0.035mm / dielectric 1.5mm / Bottom 0.035mm
Design rules "default": minimum track width 8mil, minimum drill 0.4mm, track to track 5mil, track to pad 5mil, pad to pad 5mil, via to via 5mil, smd to smd 1mil, copper to edge 10mil, drill to drill 8mil, minimum pad ring 8mil, minimum via ring 8mil, stop-mask expansion 4mil, vias tented up to drill 25mil, thermal gap 20mil
tRestrict: area 0.5,0 to 6.9,6.3; area 100.8,0.3 to 107.2,6.6; area 100.8,65.4 to 107.2,71.8; area 0,65.7 to 6.3,72; 28 lines
bRestrict: area 0.5,0 to 6.9,6.3; area 101.1,0.3 to 107.4,6.6; area 100.8,65.5 to 107.2,71.9; area -0.3,65.5 to 6.1,71.9; 19 lines

### Footprints (pad centres in the part's own frame; a part is rotated, then mirrored left to right if it is on the bottom)
A20-SOM-EVB = smd 0.7 x 1.8: 1-1 -38.735,-26.797; 1-2 -38.735,-22.733; 1-3 -37.465,-26.797; 1-4 -37.465,-22.733; 1-5 -36.195,-26.797; 1-6 -36.195,-22.733; 1-7 -34.925,-26.797; 1-8 -34.925,-22.733; 1-9 -33.655,-26.797; 1-10 -33.655,-22.733; 1-11 -32.385,-26.797; 1-12 -32.385,-22.733; 1-13 -31.115,-26.797; 1-14 -31.115,-22.733; 1-15 -29.845,-26.797; 1-16 -29.845,-22.733; 1-17 -28.575,-26.797; 1-18 -28.575,-22.733; 1-19 -27.305,-26.797; 1-20 -27.305,-22.733; 1-21 -26.035,-26.797; 1-22 -26.035,-22.733; 1-23 -24.765,-26.797; 1-24 -24.765,-22.733; 1-25 -23.495,-26.797; 1-26 -23.495,-22.733; 1-27 -22.225,-26.797; 1-28 -22.225,-22.733; 1-29 -20.955,-26.797; 1-30 -20.955,-22.733; 1-31 -19.685,-26.797; 1-32 -19.685,-22.733; 1-33 -18.415,-26.797; 1-34 -18.415,-22.733; 1-35 -17.145,-26.797; 1-36 -17.145,-22.733; 1-37 -15.875,-26.797; 1-38 -15.875,-22.733; 1-39 -14.605,-26.797; 1-40 -14.605,-22.733; 2-1 -12.065,-26.797; 2-2 -12.065,-22.733; 2-3 -10.795,-26.797; 2-4 -10.795,-22.733; 2-5 -9.525,-26.797; 2-6 -9.525,-22.733; 2-7 -8.255,-26.797; 2-8 -8.255,-22.733; 2-9 -6.985,-26.797; 2-10 -6.985,-22.733; 2-11 -5.715,-26.797; 2-12 -5.715,-22.733; 2-13 -4.445,-26.797; 2-14 -4.445,-22.733; 2-15 -3.175,-26.797; 2-16 -3.175,-22.733; 2-17 -1.905,-26.797; 2-18 -1.905,-22.733; 2-19 -0.635,-26.797; 2-20 -0.635,-22.733; 2-21 0.635,-26.797; 2-22 0.635,-22.733; 2-23 1.905,-26.797; 2-24 1.905,-22.733; 2-25 3.175,-26.797; 2-26 3.175,-22.733; 2-27 4.445,-26.797; 2-28 4.445,-22.733; 2-29 5.715,-26.797; 2-30 5.715,-22.733; 2-31 6.985,-26.797; 2-32 6.985,-22.733; 2-33 8.255,-26.797; 2-34 8.255,-22.733; 2-35 9.525,-26.797; 2-36 9.525,-22.733; 2-37 10.795,-26.797; 2-38 10.795,-22.733; 2-39 12.065,-26.797; 2-40 12.065,-22.733; 3-1 14.605,22.733; 3-2 14.605,26.797; 3-3 15.875,22.733; 3-4 15.875,26.797; 3-5 17.145,22.733; 3-6 17.145,26.797; 3-7 18.415,22.733; 3-8 18.415,26.797; 3-9 19.685,22.733; 3-10 19.685,26.797; 3-11 20.955,22.733; 3-12 20.955,26.797; 3-13 22.225,22.733; 3-14 22.225,26.797; 3-15 23.495,22.733; 3-16 23.495,26.797; 3-17 24.765,22.733; 3-18 24.765,26.797; 3-19 26.035,22.733; 3-20 26.035,26.797; 3-21 27.305,22.733; 3-22 27.305,26.797; 3-23 28.575,22.733; 3-24 28.575,26.797; 3-25 29.845,22.733; 3-26 29.845,26.797; 3-27 31.115,22.733; 3-28 31.115,26.797; 3-29 32.385,22.733; 3-30 32.385,26.797; 3-31 33.655,22.733; 3-32 33.655,26.797; 3-33 34.925,22.733; 3-34 34.925,26.797; 3-35 36.195,22.733; 3-36 36.195,26.797; 3-37 37.465,22.733; 3-38 37.465,26.797; 3-39 38.735,22.733; 3-40 38.735,26.797; 4-1 -12.065,22.733; 4-2 -12.065,26.797; 4-3 -10.795,22.733; 4-4 -10.795,26.797; 4-5 -9.525,22.733; 4-6 -9.525,26.797; 4-7 -8.255,22.733; 4-8 -8.255,26.797; 4-9 -6.985,22.733; 4-10 -6.985,26.797; 4-11 -5.715,22.733; 4-12 -5.715,26.797; 4-13 -4.445,22.733; 4-14 -4.445,26.797; 4-15 -3.175,22.733; 4-16 -3.175,26.797; 4-17 -1.905,22.733; 4-18 -1.905,26.797; 4-19 -0.635,22.733; 4-20 -0.635,26.797; 4-21 0.635,22.733; 4-22 0.635,26.797; 4-23 1.905,22.733; 4-24 1.905,26.797; 4-25 3.175,22.733; 4-26 3.175,26.797; 4-27 4.445,22.733; 4-28 4.445,26.797; 4-29 5.715,22.733; 4-30 5.715,26.797; 4-31 6.985,22.733; 4-32 6.985,26.797; 4-33 8.255,22.733; 4-34 8.255,26.797; 4-35 9.525,22.733; 4-36 9.525,26.797; 4-37 10.795,22.733; 4-38 10.795,26.797; 4-39 12.065,22.733; 4-40 12.065,26.797; 5-1 -38.735,22.733; 5-2 -38.735,26.797; 5-3 -37.465,22.733; 5-4 -37.465,26.797; 5-5 -36.195,22.733; 5-6 -36.195,26.797; 5-7 -34.925,22.733; 5-8 -34.925,26.797; 5-9 -33.655,22.733; 5-10 -33.655,26.797; 5-11 -32.385,22.733; 5-12 -32.385,26.797; 5-13 -31.115,22.733; 5-14 -31.115,26.797; 5-15 -29.845,22.733; 5-16 -29.845,26.797; 5-17 -28.575,22.733; 5-18 -28.575,26.797; 5-19 -27.305,22.733; 5-20 -27.305,26.797; 5-21 -26.035,22.733; 5-22 -26.035,26.797; 5-23 -24.765,22.733; 5-24 -24.765,26.797; 5-25 -23.495,22.733; 5-26 -23.495,26.797; 5-27 -22.225,22.733; 5-28 -22.225,26.797; 5-29 -20.955,22.733; 5-30 -20.955,26.797; 5-31 -19.685,22.733; 5-32 -19.685,26.797; 5-33 -18.415,22.733; 5-34 -18.415,26.797; 5-35 -17.145,22.733; 5-36 -17.145,26.797; 5-37 -15.875,22.733; 5-38 -15.875,26.797; 5-39 -14.605,22.733; 5-40 -14.605,26.797; LCD-1 14.605,-26.797; LCD-2 14.605,-22.733; LCD-3 15.875,-26.797; LCD-4 15.875,-22.733; LCD-5 17.145,-26.797; LCD-6 17.145,-22.733; LCD-7 18.415,-26.797; LCD-8 18.415,-22.733; LCD-9 19.685,-26.797; LCD-10 19.685,-22.733; LCD-11 20.955,-26.797; LCD-12 20.955,-22.733; LCD-13 22.225,-26.797; LCD-14 22.225,-22.733; LCD-15 23.495,-26.797; LCD-16 23.495,-22.733; LCD-17 24.765,-26.797; LCD-18 24.765,-22.733; LCD-19 26.035,-26.797; LCD-20 26.035,-22.733; LCD-21 27.305,-26.797; LCD-22 27.305,-22.733; LCD-23 28.575,-26.797; LCD-24 28.575,-22.733; LCD-25 29.845,-26.797; LCD-26 29.845,-22.733; LCD-27 31.115,-26.797; LCD-28 31.115,-22.733; LCD-29 32.385,-26.797; LCD-30 32.385,-22.733; LCD-31 33.655,-26.797; LCD-32 33.655,-22.733; LCD-33 34.925,-26.797; LCD-34 34.925,-22.733; LCD-35 36.195,-26.797; LCD-36 36.195,-22.733; LCD-37 37.465,-26.797; LCD-38 37.465,-22.733; LCD-39 38.735,-26.797; LCD-40 38.735,-22.733 | hole 0.7: -38.1,-24.765; -15.24,-24.765; -11.43,24.765; 11.43,24.765; 15.24,24.765; 38.1,24.765; -11.43,-24.765; 11.43,-24.765; -38.1,24.765; -15.24,24.765; 15.24,-24.765; 38.1,-24.765
C0603_DWS = smd 1.016 x 1.016: 1 -0.889,0; 2 0.889,0
E3,5-8 = drill 0.864 pad 1.676: + -1.778,0 | drill 0.864 pad 1.676 square: - 1.778,0
CT7343 = smd 2.6 x 2.4: + 3.2,0; - -3.2,0
E2,5-6,3 = drill 0.864 pad 1.524: + -1.27,0 | drill 0.864 pad 1.524 square: - 1.27,0
C1206_5MILS_WS_ISO = smd 1.016 x 1.778: 1 -1.778,0; 2 1.778,0
DO214AA = smd 1.778 x 2.286: A 2.177,0; C -2.177,0
TEST_PAD40/70/SQUARE = drill 1.016 pad 1.778 square: P$1 0,0
L0805_5MIL_DWS = smd 1.27 x 1.524: 1 -1.016,0; 2 1.016,0
8X7MM_3131 = smd 3.2 x 6: 1 -2.9,0; 2 2.9,0
CD42(43) = smd 1.75 x 4.5: 1 -1.6,0; 2 1.6,0
TM211Q01FM22_SH = drill 1.1: 1 -5.715,-6.35; 2 -4.445,-8.89; 3 -3.175,-6.35; 4 -1.905,-8.89; 5 -0.635,-6.35; 6 0.635,-8.89; 7 1.905,-6.35; 8 3.175,-8.89; 9 4.445,-6.35; 10 5.715,-8.89; 11 -6.731,2.54; 12 -6.731,4.572; 13 6.731,2.54; 14 6.731,4.572 | drill 1.6: SH1 -7.747,-3.048; SH2 7.747,-3.048 | hole 3.3: 5.715,0; -5.715,0
PWR_JACK_UNI_MILLING = drill 1: + 0,4.75; +1 0,5.25; +2 0,5.75; +3 0,6.25; +4 0,4.25; +5 0,3.75; +6 0,3.25; - -6.5,4.75; -1 -6.5,5.25; -2 -6.5,5.75; -3 -6.5,4.25; -4 -6.5,3.75; -5 -6.5,6.25; -6 -6.5,3.25; -- -3.3,0.3; --1 -3.8,0.3; --2 -4.3,0.3; --3 -4.8,0.3; --4 -2.8,0.3; --5 -2.3,0.3; --6 -1.8,0.3
LED-0603 = smd 1.016 x 1.016: A 0.889,0; C -0.889,0
HCX-4S = smd 1.8 x 2.4: 1 -2,0; 2 2,0
R0603_5MIL_DWS = smd 1.016 x 1.016: 1 -0.889,0; 2 0.889,0
R_MATRIX_4 = smd 0.762 x 1.016: 1.1 -1.27,-0.762; 1.2 -1.27,0.762; 4.1 1.27,-0.762; 4.2 1.27,0.762 | smd 0.508 x 1.016: 2.1 -0.381,-0.762; 2.2 -0.381,0.762; 3.1 0.381,-0.762; 3.2 0.381,0.762
SOT23-5 = smd 1.2 x 0.55: 1 1.3,-0.95; 2 1.3,0; 3 1.3,0.95; 4 -1.3,0.95; 5 -1.3,-0.95
SOIC8 = smd 0.6 x 2.2: 1 -1.905,-2.6; 2 -0.635,-2.6; 3 0.635,-2.6; 4 1.905,-2.6; 5 1.905,2.6; 6 0.635,2.6; 7 -0.635,2.6; 8 -1.905,2.6
LQFP48 = smd 0.254 x 1.4: 1 -2.75,-4.3; 2 -2.25,-4.3; 3 -1.75,-4.3; 4 -1.25,-4.3; 5 -0.75,-4.3; 6 -0.25,-4.3; 7 0.25,-4.3; 8 0.75,-4.3; 9 1.25,-4.3; 10 1.75,-4.3; 11 2.25,-4.3; 12 2.75,-4.3; 25 2.75,4.3; 26 2.25,4.3; 27 1.75,4.3; 28 1.25,4.3; 29 0.75,4.3; 30 0.25,4.3; 31 -0.25,4.3; 32 -0.75,4.3; 33 -1.25,4.3; 34 -1.75,4.3; 35 -2.25,4.3; 36 -2.75,4.3 | smd 1.4 x 0.254: 13 4.3,-2.75; 14 4.3,-2.25; 15 4.3,-1.75; 16 4.3,-1.25; 17 4.3,-0.75; 18 4.3,-0.25; 19 4.3,0.25; 20 4.3,0.75; 21 4.3,1.25; 22 4.3,1.75; 23 4.3,2.25; 24 4.3,2.75; 37 -4.3,2.75; 38 -4.3,2.25; 39 -4.3,1.75; 40 -4.3,1.25; 41 -4.3,0.75; 42 -4.3,0.25; 43 -4.3,-0.25; 44 -4.3,-0.75; 45 -4.3,-1.25; 46 -4.3,-1.75; 47 -4.3,-2.25; 48 -4.3,-2.75
RTL8188CUS-MOD = smd 2.6 x 1: 3V3 7,-5.5; ANT -6,1.5; D+ 7,0.5; D- 7,-3; GND 7,3; RF_GND -6,3.5
SATA-CON = smd 0.9 x 2.4: D1 15.88,0; D2 14.61,0; D3 13.34,0; D4 12.07,0; D5 10.8,0; D6 9.53,0; D7 8.26,0; P1 1.91,0; P2 0.64,0; P3 -0.63,0; P4 -1.9,-0.5; P5 -3.17,0; P6 -4.44,0; P7 -5.71,0; P8 -6.98,0; P9 -8.25,0; P10 -9.52,0; P11 -10.79,0; P12 -12.06,-0.5; P13 -13.33,0; P14 -14.6,0; P15 -15.87,0 | drill 1: P$23 -18.71,-2.24; P$24 18.71,-2.24; P$25 -18.71,-1.74; P$26 -18.71,-2.74; P$27 18.71,-1.74; P$28 18.71,-2.74 | hole 1.6: -16.595,-3; 16.595,-3
PN87520 = drill 0.95 long: 1 -3.5,2.71; 2 -1,2.71; 3 1,2.71; 4 3.5,2.71 | hole 2.3: -6.57,0; 6.57,0
BU-SMA-H = drill 1.27: 1 0,0 | drill 1.778: 2 -2.55,2.55; 3 2.55,2.55; 4 2.55,-2.55; 5 -2.55,-2.55

### Placement (x,y rotation side)
A20-SOM-EVB_PLATFORM  59.82,31.24 180 top
C13  14.78,53.59 90 top
C14  12.24,61.59 0 top
C15  12.37,52.2 0 top
C16  12.37,54.48 0 top
C17  94.61,45.77 0 top
C18  94.61,44.24 0 top
C19  94.61,42.34 0 top
C20  94.61,40.81 0 top
C21  58.04,30.48 90 top
C22  59.56,30.48 90 top
C32  9.39,21.01 270 top
C33  36.45,28.07 90 top
C34  37.97,28.07 90 top
C35  25.78,42.93 0 top
C36  19.81,20.76 0 top
C37  45.59,30.99 180 top
C38  45.59,32.51 180 top
C39  22.55,12.76 270 top
C40  21.03,16.06 90 top
C41  47.24,41.66 180 top
C42  47.24,39.88 0 top
C43  28.83,45.59 270 top
C44  14.46,4.83 0 top
C45  19.81,23.81 0 top
C46  22.55,16.06 90 top
C47  21.03,12.76 270 top
C48  25.53,34.8 90 top
C50  28.57,34.8 90 top
C51  27.05,34.8 90 top
C52  26.04,28.45 270 top
C53  27.56,28.45 270 top
C54  39.75,28.07 90 top
C55  25.78,44.45 0 top
C56  40.01,45.34 270 top
C57  33.66,45.59 270 top
C58  34.93,28.07 90 top
C59  20.07,35.56 180 top
C61  20.07,37.08 180 top
C62  27.69,41.27 0 top
C64  24.38,41.27 180 top
C65  41.53,45.34 270 top
C66  19.25,12.76 270 top
C68  14.78,56.39 270 bottom
C69  13.71,66.01 0 top
C71  4.7,45.85 0 top
D1  25.09,14.66 270 top
GND_PIN  3.13,66.93 180 top
L7  13.64,50.42 0 top
L10  13.79,14.66 0 top
L11  45.85,27.05 180 top
L12  45.85,29.08 180 top
L13  23.75,34.54 90 top
L14  31.11,28.45 270 top
LAN  6.22,36.2 90 top
PWR  8.64,1.35 0 top
PWR_LED  96.42,66.37 180 top
Q1  26.8,38.48 0 top
R10  16.3,57.78 90 top
R11  14.78,57.78 90 top
R37  19.81,22.28 180 top
R38  19.25,16.06 270 top
R39  96.42,62.15 180 top
R40  41.28,28.07 270 top
R41  42.8,28.07 270 top
R42  47.24,38.35 0 top
R43  31.24,44.7 0 top
R44  31.24,46.48 0 top
R45  22.22,19.87 270 top
R46  19.81,18.98 0 top
R47  20.07,44.32 180 top
R48  20.07,45.85 0 top
R49  37.21,45.59 90 top
R52  26.42,32.38 0 top
R57  46.1,45.34 270 top
R59  20.07,28.07 180 top
R60  20.07,34.04 0 top
R61  20.07,26.54 180 top
R62  20.07,32.26 0 top
R63  43.05,45.34 270 top
R64  44.58,45.34 270 top
R65  51.31,39.24 90 top
R66  35.69,45.59 270 top
RM4  50.8,31.24 270 top
RM5  47.24,35.31 270 top
U3  12.49,57.78 270 top
U7  14.22,21.01 270 top
U8  36.7,36.2 0 top
U$1  35.51,18 0 top
U$2  95.51,31 90 bottom
U$5  [LOGO-OPENHARDWARE_8X8]  53.47,8.89 0 bottom
U$11  [RECYCLE_BIN1/8]  45.59,3.81 0 bottom
X1  5.51,56 270 top
X2  4.51,17 180 top

### Tracks (layer width: path | path; a pad name or v marks a point on that pad's centre or on a via)
+5V  (9 unrouted)
+12V  (4 unrouted)
+15V  (9 unrouted)
ANT  (1 unrouted)
AVDD33  (5 unrouted)
AVDD/DVDD(1.05V)  (12 unrouted)
CLK125  (1 unrouted)
DVDD33  (9 unrouted)
EMDC  (1 unrouted)
EMDIO  (2 unrouted)
EPHY-RST#  (1 unrouted)
ERXCK  (1 unrouted)
ERXD0  (1 unrouted)
ERXD1  (1 unrouted)
ERXD2  (1 unrouted)
ERXD3  (1 unrouted)
ERXDV  (1 unrouted)
ETXCK  (1 unrouted)
ETXD0  (1 unrouted)
ETXD1  (1 unrouted)
ETXD2  (1 unrouted)
ETXD3  (1 unrouted)
ETXEN  (1 unrouted)
GND  (84 unrouted)
MDI[0]+  (1 unrouted)
MDI[0]-  (1 unrouted)
MDI[1]+  (1 unrouted)
MDI[1]-  (1 unrouted)
MDI[2]+  (1 unrouted)
MDI[2]-  (1 unrouted)
MDI[3]+  (1 unrouted)
MDI[3]-  (1 unrouted)
N$6  (1 unrouted)
N$7  (1 unrouted)
N$8  (1 unrouted)
N$9  (2 unrouted)
N$10  (1 unrouted)
N$11  (1 unrouted)
N$12
  pour Top (isolate 0.61, rank 3): 10.67,28.32 10.67,45.85 9.91,46.61 5.97,46.61 5.71,46.35 5.71,42.29 4.32,40.89 -0.89,40.89 -0.89,31.5 4.32,31.5 5.33,30.48 5.33,28.83 5.84,28.32
  pour Bottom (isolate 0.61, rank 3): 7.11,44.2 11.05,44.2 11.05,28.32 5.84,28.32 5.33,28.83 5.33,30.48 4.32,31.5 -0.38,31.5 -0.38,40.89 4.32,40.89 6.6,43.18 6.6,43.69
N$13  (1 unrouted)
N$15  (2 unrouted)
N$16  (2 unrouted)
N$17  (1 unrouted)
N$18  (1 unrouted)
N$19  (4 unrouted)
N$20  (1 unrouted)
N$21  (2 unrouted)
N$22  (1 unrouted)
N$23  (2 unrouted)
N$24  (2 unrouted)
N$25  (1 unrouted)
N$26  (2 unrouted)
N$27  (1 unrouted)
N$28  (2 unrouted)
N$29  (1 unrouted)
N$30  (3 unrouted)
N$31  (2 unrouted)
N$32  (2 unrouted)
N$46  (2 unrouted)
N$62  (2 unrouted)
N$106  (1 unrouted)
N$112  (1 unrouted)
N$113  (1 unrouted)
N$114  (1 unrouted)
N$129  (1 unrouted)
N$137  (1 unrouted)
N$194  (2 unrouted)
N$195  (5 unrouted)
RESET_N  (1 unrouted)
SATA-RXM  (1 unrouted)
SATA-RXP  (1 unrouted)
SATA-TXM  (1 unrouted)
SATA-TXP  (1 unrouted)
UDM1  (1 unrouted)
UDM2  (1 unrouted)
UDP1  (1 unrouted)
UDP2  (1 unrouted)
USB2-DRV  (2 unrouted)
VCC  (13 unrouted)
VDDREG  (5 unrouted)

### Text on the board
tNames: 6-16VDC | + | + | A20_CON-GPIO3 | - | A20_CON-GPIO1 | +
bNames: + | + | + | 6-16VDC